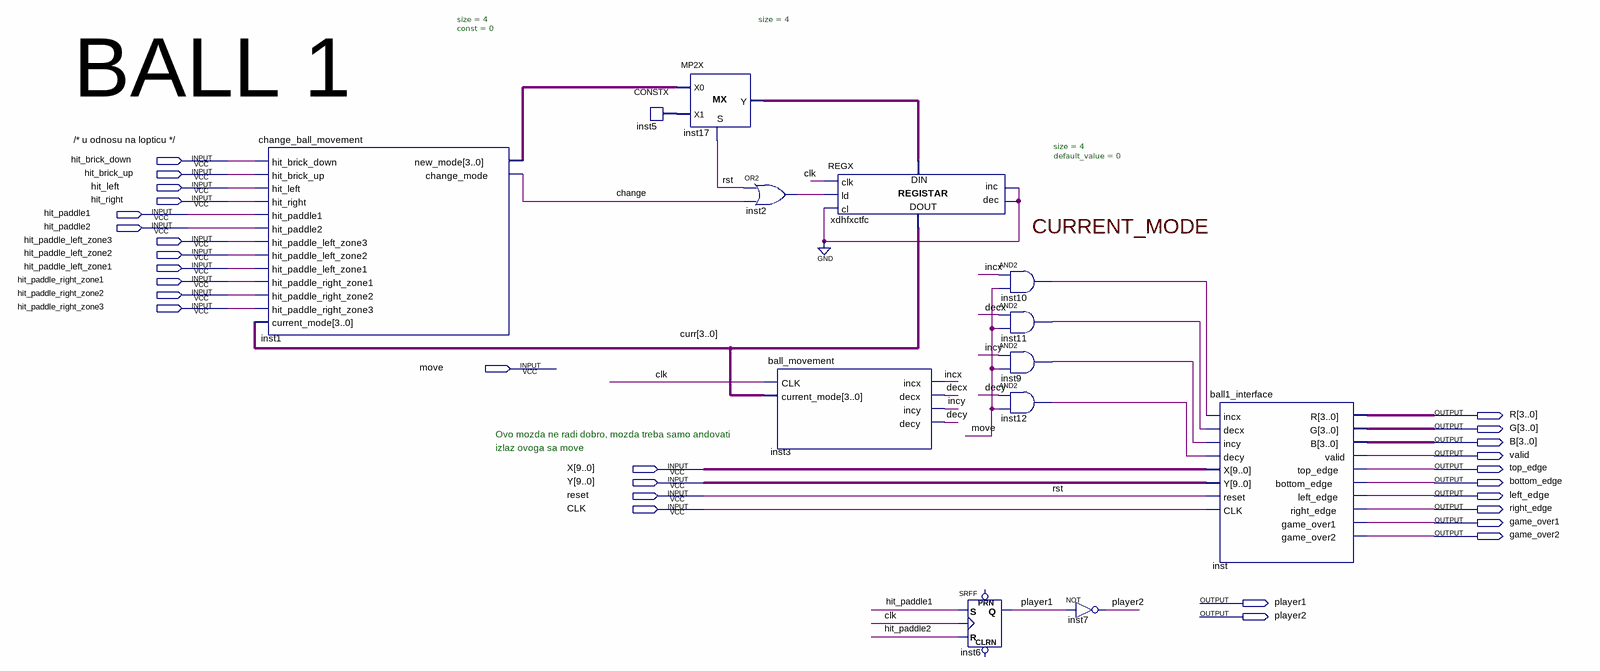
[diagram p0: schematic sheet]
// Quartus schematic ball1.bdf as structural Verilog: 13 symbols, 29 pins
module ball1 (
  input  hit_brick_down,
  input  hit_brick_up,
  input  hit_left,
  input  hit_right,
  input  hit_paddle1,
  input  hit_paddle2,
  input  hit_paddle_left_zone3,
  input  hit_paddle_left_zone2,
  input  hit_paddle_left_zone1,
  input  hit_paddle_right_zone1,
  input  hit_paddle_right_zone2,
  input  hit_paddle_right_zone3,
  input  move,
  input  [9:0] X,
  input  [9:0] Y,
  input  reset,
  input  CLK,
  output [3:0] R,
  output [3:0] G,
  output [3:0] B,
  output valid,
  output top_edge,
  output bottom_edge,
  output left_edge,
  output right_edge,
  output game_over1,
  output game_over2,
  output player1,
  output player2
);

  wire change, decx, decy, incx, incy, inst2_out, inst9_out, inst10_out, inst11_out, inst12_out;
  wire [3:0] curr, inst1_new_mode, inst5_data, inst17_y;

  change_ball_movement inst1 (
    .hit_brick_down(hit_brick_down), .hit_brick_up(hit_brick_up), .hit_left(hit_left), .hit_right(hit_right),
    .hit_paddle1(hit_paddle1), .hit_paddle2(hit_paddle2), .hit_paddle_left_zone3(hit_paddle_left_zone3),
    .hit_paddle_left_zone2(hit_paddle_left_zone2), .hit_paddle_left_zone1(hit_paddle_left_zone1),
    .hit_paddle_right_zone1(hit_paddle_right_zone1), .hit_paddle_right_zone2(hit_paddle_right_zone2),
    .hit_paddle_right_zone3(hit_paddle_right_zone3), .current_mode(curr), .new_mode(inst1_new_mode),
    .change_mode(change));
  CONSTX #(.size(4), .\const (0)) inst5 (.data(inst5_data));
  MP2X #(.size(4)) inst17 (.S(reset), .X0(inst1_new_mode), .X1(inst5_data), .Y(inst17_y));
  or inst2 (inst2_out, reset, change);
  ball_movement inst3 (.CLK(CLK), .current_mode(curr), .incx(incx), .decx(decx), .incy(incy), .decy(decy));
  REGX #(.size(4), .default_value(0)) xdhfxctfc (
    .clk(CLK), .ld(inst2_out), .cl(1'b0), .inc(1'b0), .dec(1'b0), .data_in(inst17_y), .data_out(curr));
  SRFF inst6 (.S(hit_paddle1), .R(hit_paddle2), .CLK(CLK), .Q(player1));  // open: PRN, CLRN
  and inst10 (inst10_out, incx, move);
  and inst11 (inst11_out, decx, move);
  and inst9 (inst9_out, incy, move);
  and inst12 (inst12_out, decy, move);
  not inst7 (player2, player1);
  ball1_interface inst (
    .incx(inst10_out), .decx(inst11_out), .incy(inst9_out), .decy(inst12_out), .X(X), .Y(Y), .reset(reset),
    .CLK(CLK), .R(R), .G(G), .B(B), .valid(valid), .top_edge(top_edge), .bottom_edge(bottom_edge),
    .left_edge(left_edge), .right_edge(right_edge), .game_over1(game_over1), .game_over2(game_over2));

  // Other names for the same wires on the sheet: rst = reset

  // Notes on the sheet:
  //   BALL 1
  //   /* u odnosu na lopticu */
  //   CURRENT_MODE
  //   Ovo mozda ne radi dobro, mozda treba samo andovati
  //   izlaz ovoga sa move
endmodule
